# Altium project Flight_Controller.PrjPcb
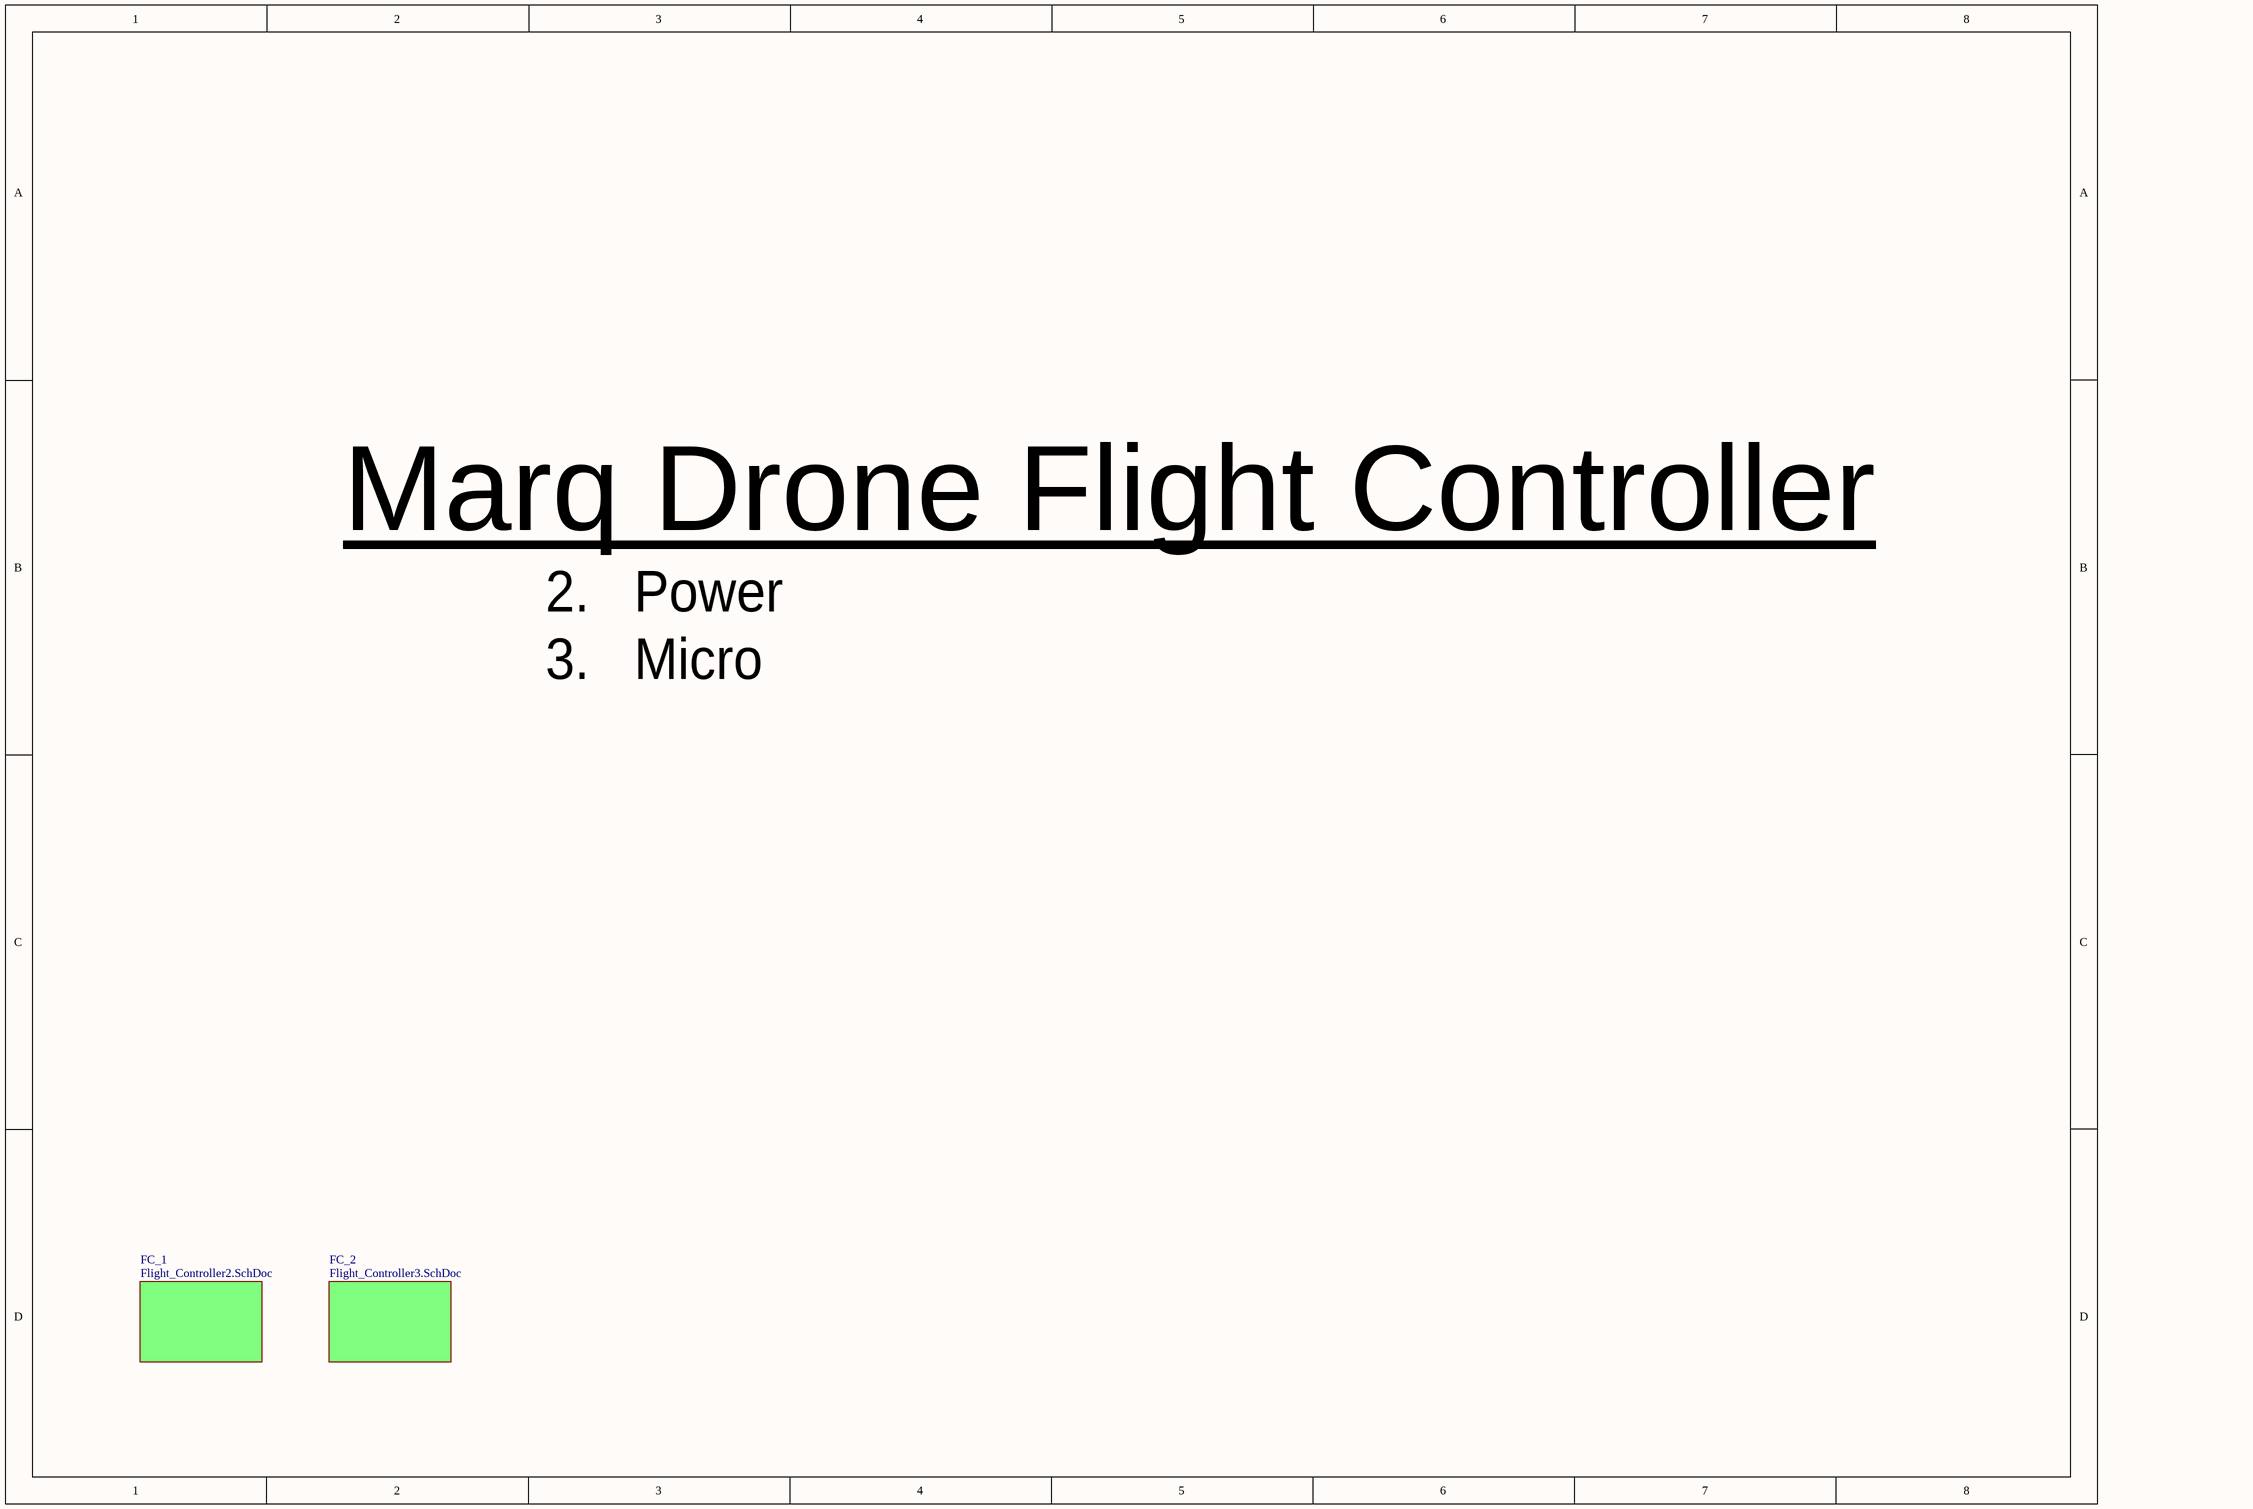
[diagram p0: Flight_Controller1.SchDoc]
3 sheets, 67 parts. Net scope: global (net labels, ports and power ports of the same name join across sheets).
Board file: Flight_Controller.PcbDoc
Sheets:
  Flight_Controller1.SchDoc
    FC_1 = Flight_Controller2.SchDoc
    FC_2 = Flight_Controller3.SchDoc

## Sheet Flight_Controller1.SchDoc: Sensorless BLDC Controller
size A3; PageSetup: Record=PageOptions|CenterHorizontal=True|CenterVertical=True|PrintScale=0.34|XCorrection=1.00|YCorrection=1.00|PrintKind=1|BorderSize=5000000|LeftOffset=0|BottomOffset=0|Orientation=2|PaperLength=1000|PaperWidth=1000|Scale=100|PaperSource=7|PrintQuality=-3|MediaType=1|DitherType=10|PrintScaleMode=1|PaperKind=A3|PaperIndex=8

### Sub-sheets
FC_1 = Flight_Controller2.SchDoc: no entries
FC_2 = Flight_Controller3.SchDoc: no entries

### Notes on the sheet
- Marq Drone Flight Controller
- 2.   Power
- 3.   Micro

## Sheet Flight_Controller2.SchDoc: Sensorless BLDC Controller
size A3; PageSetup: Record=PageOptions|CenterHorizontal=True|CenterVertical=True|PrintScale=0.34|XCorrection=1.00|YCorrection=1.00|PrintKind=1|BorderSize=5000000|LeftOffset=0|BottomOffset=0|Orientation=2|PaperLength=1000|PaperWidth=1000|Scale=100|PaperSource=7|PrintQuality=-3|MediaType=1|DitherType=10|PrintScaleMode=1|PaperKind=A3|PaperIndex=8
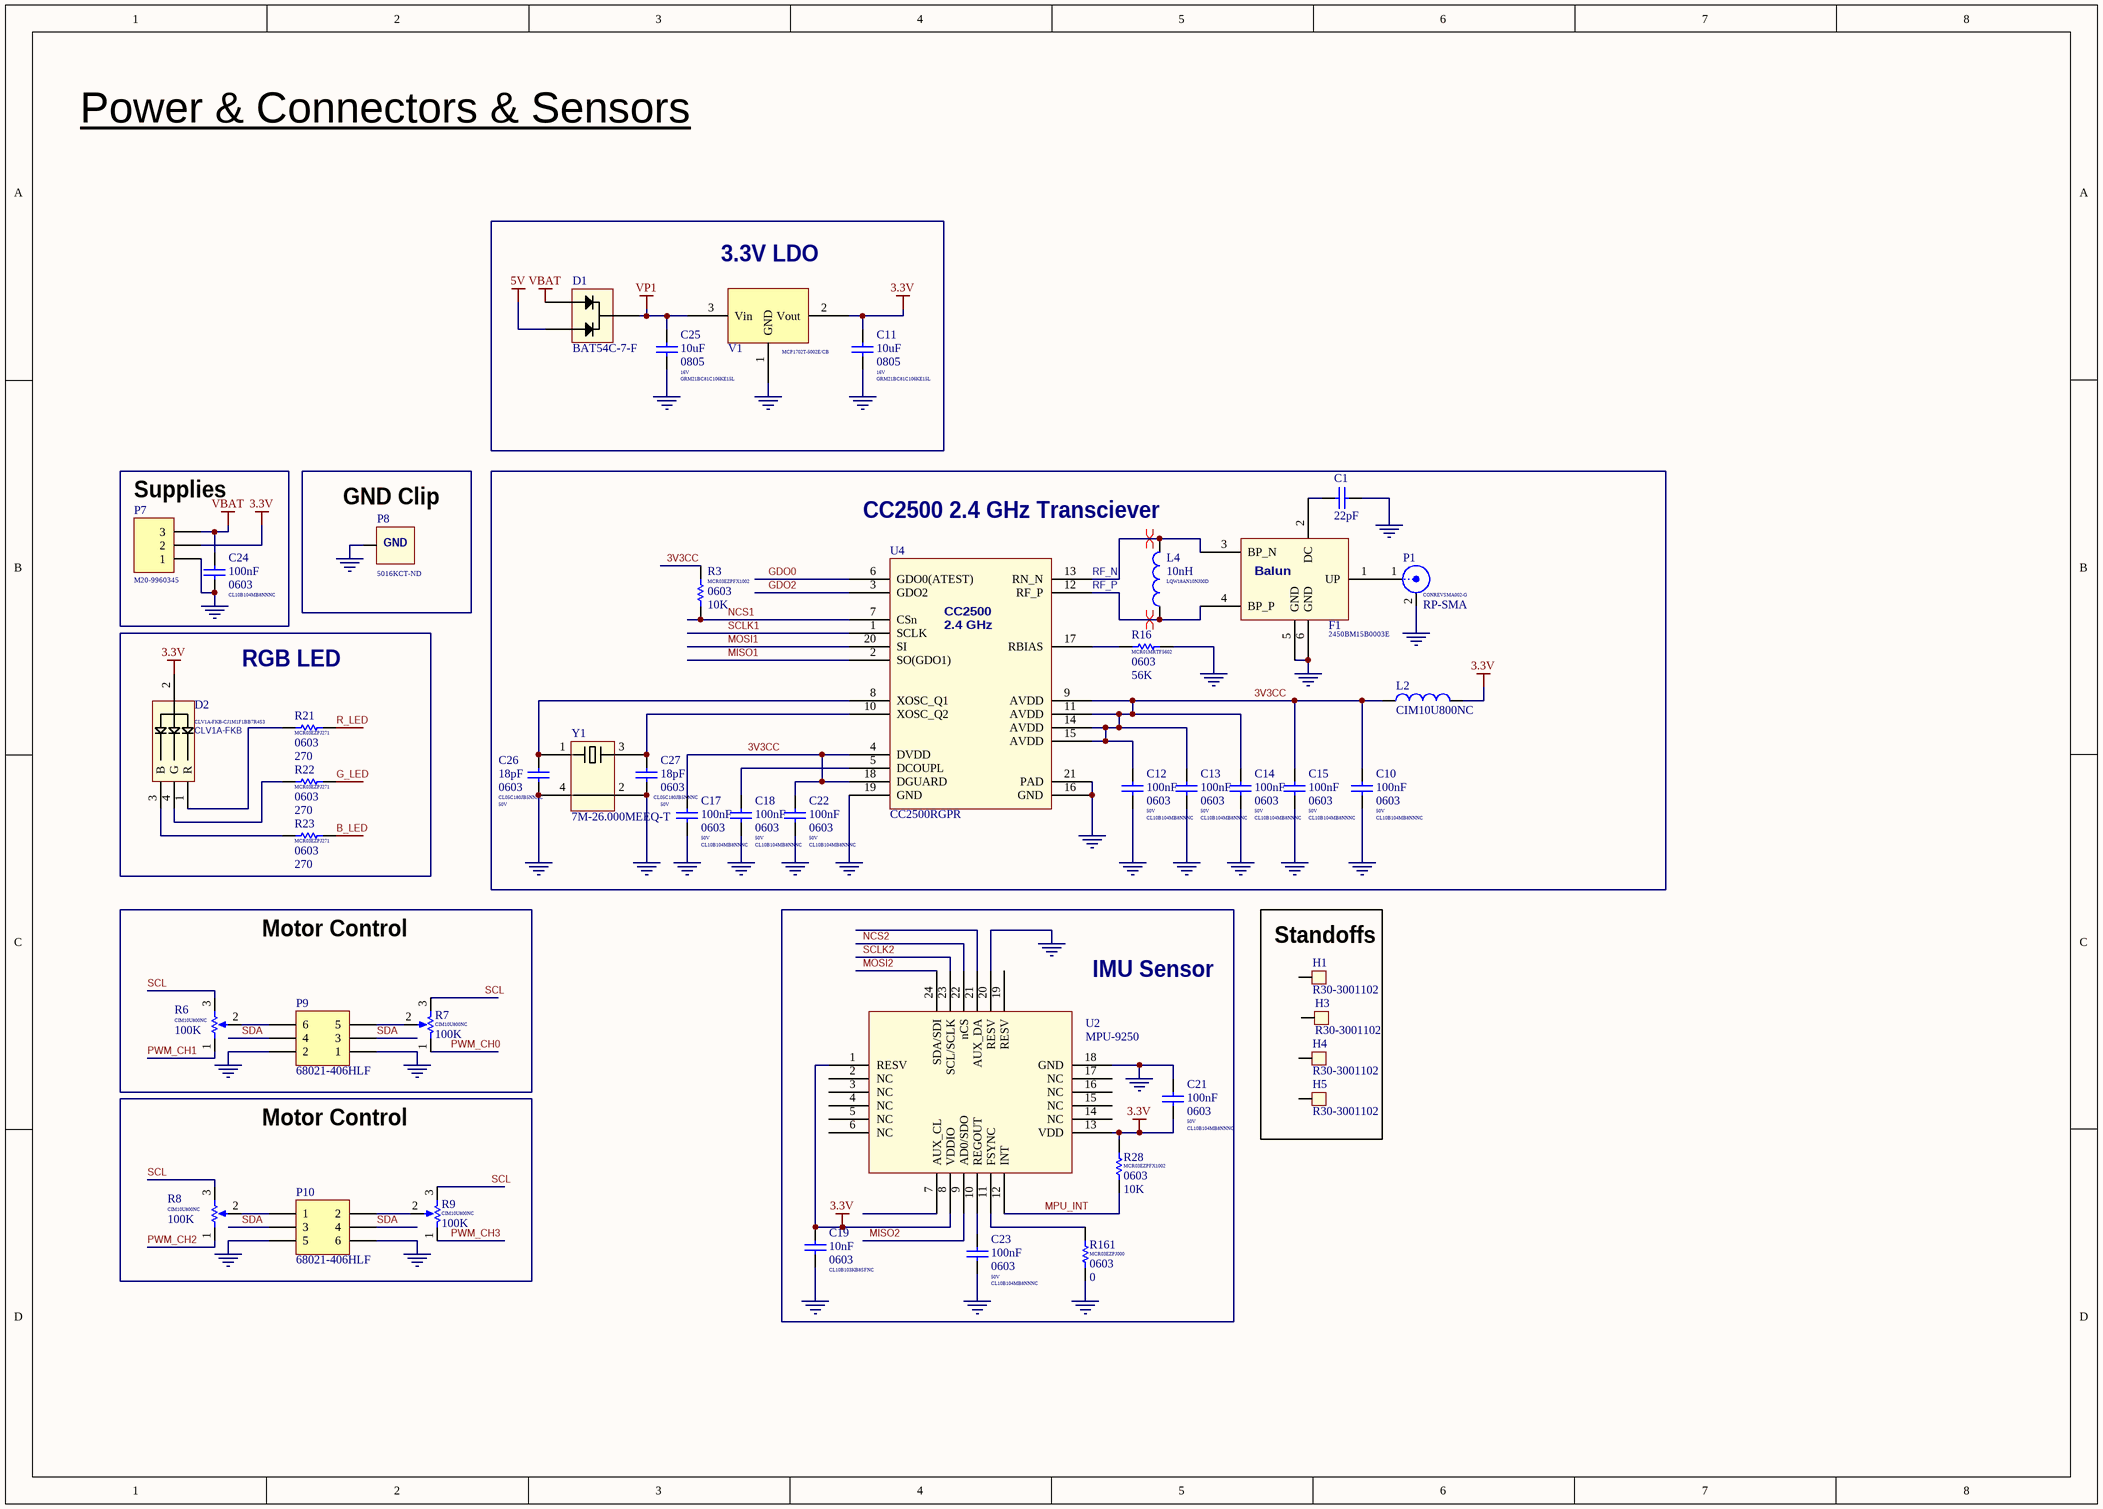
[diagram p1: Flight_Controller2.SchDoc]

### Parts
C1  value 22pF  [1608[0603]C]  (hidden comment: GRM1885C1H220FA01D)
C10  CL10B104MB8NNNC  value 100nF  PackageReference: 0603  Voltage: 50V  [1608[0603]C]
C11  GRM21BC81C106KE15L  value 10uF  PackageReference: 0805  Voltage: 16V  [6-0805_MC]
C12  CL10B104MB8NNNC  value 100nF  PackageReference: 0603  Voltage: 50V  [1608[0603]C]
C13  CL10B104MB8NNNC  value 100nF  PackageReference: 0603  Voltage: 50V  [1608[0603]C]
C14  CL10B104MB8NNNC  value 100nF  PackageReference: 0603  Voltage: 50V  [1608[0603]C]
C15  CL10B104MB8NNNC  value 100nF  PackageReference: 0603  Voltage: 50V  [1608[0603]C]
C17  CL10B104MB8NNNC  value 100nF  PackageReference: 0603  Voltage: 50V  [1608[0603]C]
C18  CL10B104MB8NNNC  value 100nF  PackageReference: 0603  Voltage: 50V  [1608[0603]C]
C19  CL10B103KB8SFNC  value 10nF  PackageReference: 0603  [1608[0603]C]
C21  CL10B104MB8NNNC  value 100nF  PackageReference: 0603  Voltage: 50V  [1608[0603]C]
C22  CL10B104MB8NNNC  value 100nF  PackageReference: 0603  Voltage: 50V  [1608[0603]C]
C23  CL10B104MB8NNNC  value 100nF  PackageReference: 0603  Voltage: 50V  [1608[0603]C]
C24  CL10B104MB8NNNC  value 100nF  PackageReference: 0603  [1608[0603]C]
C25  GRM21BC81C106KE15L  value 10uF  PackageReference: 0805  Voltage: 16V  [6-0805_MC]
C26  CL05C180JB5NNNC  value 18pF  PackageReference: 0603  Voltage: 50V  [1608[0603]C]
C27  CL05C180JB5NNNC  value 18pF  PackageReference: 0603  Voltage: 50V  [1608[0603]C]
D1  BAT54C-7-F  [SOT-23B_M_3D]
D2  CLV1A-FKB-CJ1M1F1BB7R4S3  [CLV1A-FKB_RGB_3D]
F1  2450BM15B0003E  [Balun]
H1  R30-3001102  [M3_Standoff_3]
H3  R30-3001102  [M3_Standoff_3]
H4  R30-3001102  [M3_Standoff_3]
H5  R30-3001102  [M3_Standoff_3]
L2  CIM10U800NC  [1608[0603]L]
L4  LQW18AN10NJ00D  value 10nH  [1608[0603]L]
P1  CONREVSMA002-G  SMA: RP-SMA  [SMA1]
P7  M20-9960345  [HDR1X3]
P8  5016KCT-ND  [GND_CLIP3]
P9  68021-406HLF  [HDR2X3_3D2]
P10  68021-406HLF  [HDR2X3_3D2]
R3  MCR03EZPFX1002  value 10K  PackageReference: 0603  [1608[0603]R]
R6  CIM10U800NC  value 100K  [1608[0603]TRI]
R7  CIM10U800NC  value 100K  [1608[0603]TRI]
R8  CIM10U800NC  value 100K  [1608[0603]TRI]
R9  CIM10U800NC  value 100K  [1608[0603]TRI]
R16  MCR01MRTF5602  value 56K  PackageReference: 0603  [1608[0603]R]
R21  MCR03EZPJ271  value 270  PackageReference: 0603  [1608[0603]R]
R22  MCR03EZPJ271  value 270  PackageReference: 0603  [1608[0603]R]
R23  MCR03EZPJ271  value 270  PackageReference: 0603  [1608[0603]R]
R28  MCR03EZPFX1002  value 10K  PackageReference: 0603  [1608[0603]R]
R161  MCR03EZPJ000  value 0  PackageReference: 0603  [1608[0603]R]
U2  MPU-9250  [QFN-24/3MM]
U4  CC2500RGPR  [QFN50P400X400-20VM]
V1  MCP1702T-5002E/CB  [SOT-23B_M_3D]
Y1  7M-26.000MEEQ-T  [3225_Crystal]

### Blocks framed on the sheet
3.3V LDO: C11 C25 D1 V1
Supplies: C24 P7
GND Clip: P8
CC2500 2.4 GHz Transciever: C1 C10 C12-C15 C17 C18 C22 C26 C27 F1 L2 L4 P1 R3 R16 U4 Y1
RGB LED: D2 R21-R23
Motor Control: P9 R6 R7
IMU Sensor: C19 C21 C23 R28 R161 U2
Standoffs: H1 H3-H5
Motor Control: P10 R8 R9

### Nets
3.3V: C11.2 C19.2 C21.1 D2.2(V+) L2.1 P7.2 R28.2 U2.1(RESV) U2.8(VDDIO) U2.13(VDD) V1.2(Vout)
5V: D1.2
GND: C1.2 C10.1 C11.1 C12.1 C13.1 C14.1 C15.1 C17.1 C18.1 C19.1 C21.2 C22.1 C23.1 C24.1 C25.1 C26.1 C27.1 F1.5(GND) F1.6(GND) P1.2(Y) P7.1 P8.1(GND) P9.1 P9.2 P10.5 P10.6 R16.1 R161.2 U2.18(GND) U2.20(RESV) U4.16(GND) U4.19(GND) U4.21(PAD) V1.1(GND) Y1.2(GND) Y1.4(GND)
VBAT: C24.2 D1.1 P7.3
VP1: C25.2 D1.3 V1.3(Vin)
3V3CC: C10.2 C12.2 C13.2 C14.2 C15.2 C17.2 C22.2 L2.2 R3.2 U4.4(DVDD) U4.9(AVDD) U4.11(AVDD) U4.14(AVDD) U4.15(AVDD) U4.18(DGUARD)
B_LED: R23.2
G_LED: R22.2
GDO0: U4.6(GDO0(ATEST))
GDO2: U4.3(GDO2)
MISO1: U4.2(SO(GDO1))
MISO2: U2.9(AD0/SDO)
MOSI1: U4.20(SI)
MOSI2: U2.24(SDA/SDI)
MPU_INT: R28.1 U2.12(INT)
NCS1: R3.1 U4.7(CSn)
NCS2: U2.22(nCS)
PWM_CH0: R7.1
PWM_CH1: R6.1
PWM_CH2: R8.1
PWM_CH3: R9.1
R_LED: R21.2
RF_N: F1.3(BP_N) L4.1 U4.13(RN_N)
RF_P: F1.4(BP_P) L4.2 U4.12(RF_P)
SCL: R6.3 R7.3 R8.3 R9.3
SCLK1: U4.1(SCLK)
SCLK2: U2.23(SCL/SCLK)
SDA: P9.3 P9.4 P10.3 P10.4
NetC1_1: C1.1 F1.2(DC)
NetC18_2: C18.2 U4.5(DCOUPL)
NetC23_2: C23.2 U2.10(REGOUT)
NetC26_2: C26.2 U4.8(XOSC_Q1) Y1.1(X1)
NetC27_2: C27.2 U4.10(XOSC_Q2) Y1.3(X2)
NetD2_1: D2.1(R) R21.1
NetD2_3: D2.3(B) R23.1
NetD2_4: D2.4(G) R22.1
NetF1_1: F1.1(UP) P1.1(X)
NetP9_5: P9.5 R7.2
NetP9_6: P9.6 R6.2
NetP10_1: P10.1 R8.2
NetP10_2: P10.2 R9.2
NetR16_2: R16.2 U4.17(RBIAS)
NetR161_1: R161.1 U2.11(FSYNC)

Not connected (* = marked no-connect by the designer): H1 1(0); H3 1(0); H4 1(0); H5 1(0); U2 2(NC) 3(NC) 4(NC) 5(NC) 6(NC) 7(AUX_CL) 14(NC) 15(NC) 16(NC) 17(NC) 19(RESV) 21(AUX_DA)

### Layout directives
differential pair: RF_N, RF_P

### Notes on the sheet
- Power & Connectors & Sensors
- (in symbol BALUN_2_4_GHZ) Balun
- (in symbol CC2500_2_4_ghz) CC2500; 2.4 GHz
- (in symbol RGB_LED_SMT) CLV1A-FKB

### Library data of the parts
C1 = Cap Semi: Capacitor (Semiconductor SIM Model); Published: 8-Jun-2000; LatestRevisionDate: 29-May-2009; LatestRevisionNote: IPC-7351 Footprint Added.; PackageReference: C1206; Publisher: Altium Limited; PackageDescription: Chip Capacitor; Digikey: 311-1361-1-ND
C10 C12-C15 C17 C18 C21-C24 = Cap Semi: Capacitor (Semiconductor SIM Model); PP1: 0.01210; Page: PowerInput; PackageDescription: Chip Capacitor; Digikey: 311-1361-1-ND; Part_Number: CL10B104MB8NNNC; PP100: 0.01210
C11 C25 = Cap Semi: Capacitor (Semiconductor SIM Model); Part_Number: CL10B104MB8NNNC; PP1: 0.20000; PP100: 0.06560; Page: Ethernet; PackageDescription: Chip Capacitor; Digikey: 311-1361-1-ND; ClassName: ETH_2; EXT: EXT
C19 = Cap Semi: Capacitor (Semiconductor SIM Model); PP100: 0.00910; Page: Analog; Published: 8-Jun-2000; LatestRevisionDate: 29-May-2009; LatestRevisionNote: IPC-7351 Footprint Added.; Publisher: Altium Limited; PackageDescription: Chip Capacitor; Digikey: 311-1361-1-ND; PP1: 0.00910; ClassName: AI_5
C26 C27 = Cap Semi: Capacitor (Semiconductor SIM Model); PP1: 0.00610; Page: Micro; PackageDescription: Chip Capacitor; Digikey: 311-1361-1-ND; PP100: 0.00610
D1 = Bat45C
D2 = RGB_LED_SMT: SMT RGB LED
F1 = BALUN_2_4_GHZ: 2450BM15B0003; Part Number: 2450BM15B0003
H1 H3-H5 = stand_off: Populate: DNP; Page: PowerInput
L2 = Inductor: PP1: 0.1900; PP100: 0.0620; Page: Micro
L4 = Inductor
P1 = SMB: SMB Straight Connector; Part #: 5-1814832-1
P7 = Header 3: Header, 3-Pin; LatestRevisionDate: 17-Jul-2002; LatestRevisionNote: Re-released for DXP Platform.; Publisher: Altium Limited
P8 = GND_CLIP: PP100: 0.26530; PP1: 0.40000; Page: PowerInput
P9 P10 = Header 3X2: Header, 3-Pin, Dual row; LatestRevisionDate: 17-Jul-2002; LatestRevisionNote: Re-released for DXP Platform.; Publisher: Altium Limited
R3 R16 R28 = Res1: Resistor; Part_Number: MCR03ERTJ102; PP1: 0.10000; PP100: 0.00780; Page: PowerInput
R6-R9 = RPot: Potentiometer; Sim Note: Enter the Resistance value and the set point into parameter fields.; Set Position: 0.5; Published: 8-Jun-2000; LatestRevisionDate: 17-Jul-2002; LatestRevisionNote: Re-released for DXP Platform.; PackageReference: VR5; Publisher: Altium Limited; PackageDescription: Variable Resistor, Thru-Hole; 3 Leads
R21-R23 = Res1: Resistor; Part_Number: MCR03ERTJ102; PP1: 0.10000; PP100: 0.00780; Page: Ethernet; ClassName: ETH_2
R161 = Res1: Resistor; Part_Number: MCR03ERTJ102; PP1: 0.10000; PP100: 0.00620; Page: Analog; ClassName: AI_3
U2 = MPU-9250_LIB
U4 = CC2500_2_4_ghz
V1 = MCP1700: MCP1700 3.3V REG
Y1 = 12MHz_Crystal: 26 MHz Crystal 3225

## Sheet Flight_Controller3.SchDoc: Sensorless BLDC Controller
size A3; PageSetup: Record=PageOptions|CenterHorizontal=True|CenterVertical=True|PrintScale=0.34|XCorrection=1.00|YCorrection=1.00|PrintKind=1|BorderSize=5000000|LeftOffset=0|BottomOffset=0|Orientation=2|PaperLength=1000|PaperWidth=1000|Scale=100|PaperSource=7|PrintQuality=-3|MediaType=1|DitherType=10|PrintScaleMode=1|PaperKind=A3|PaperIndex=8
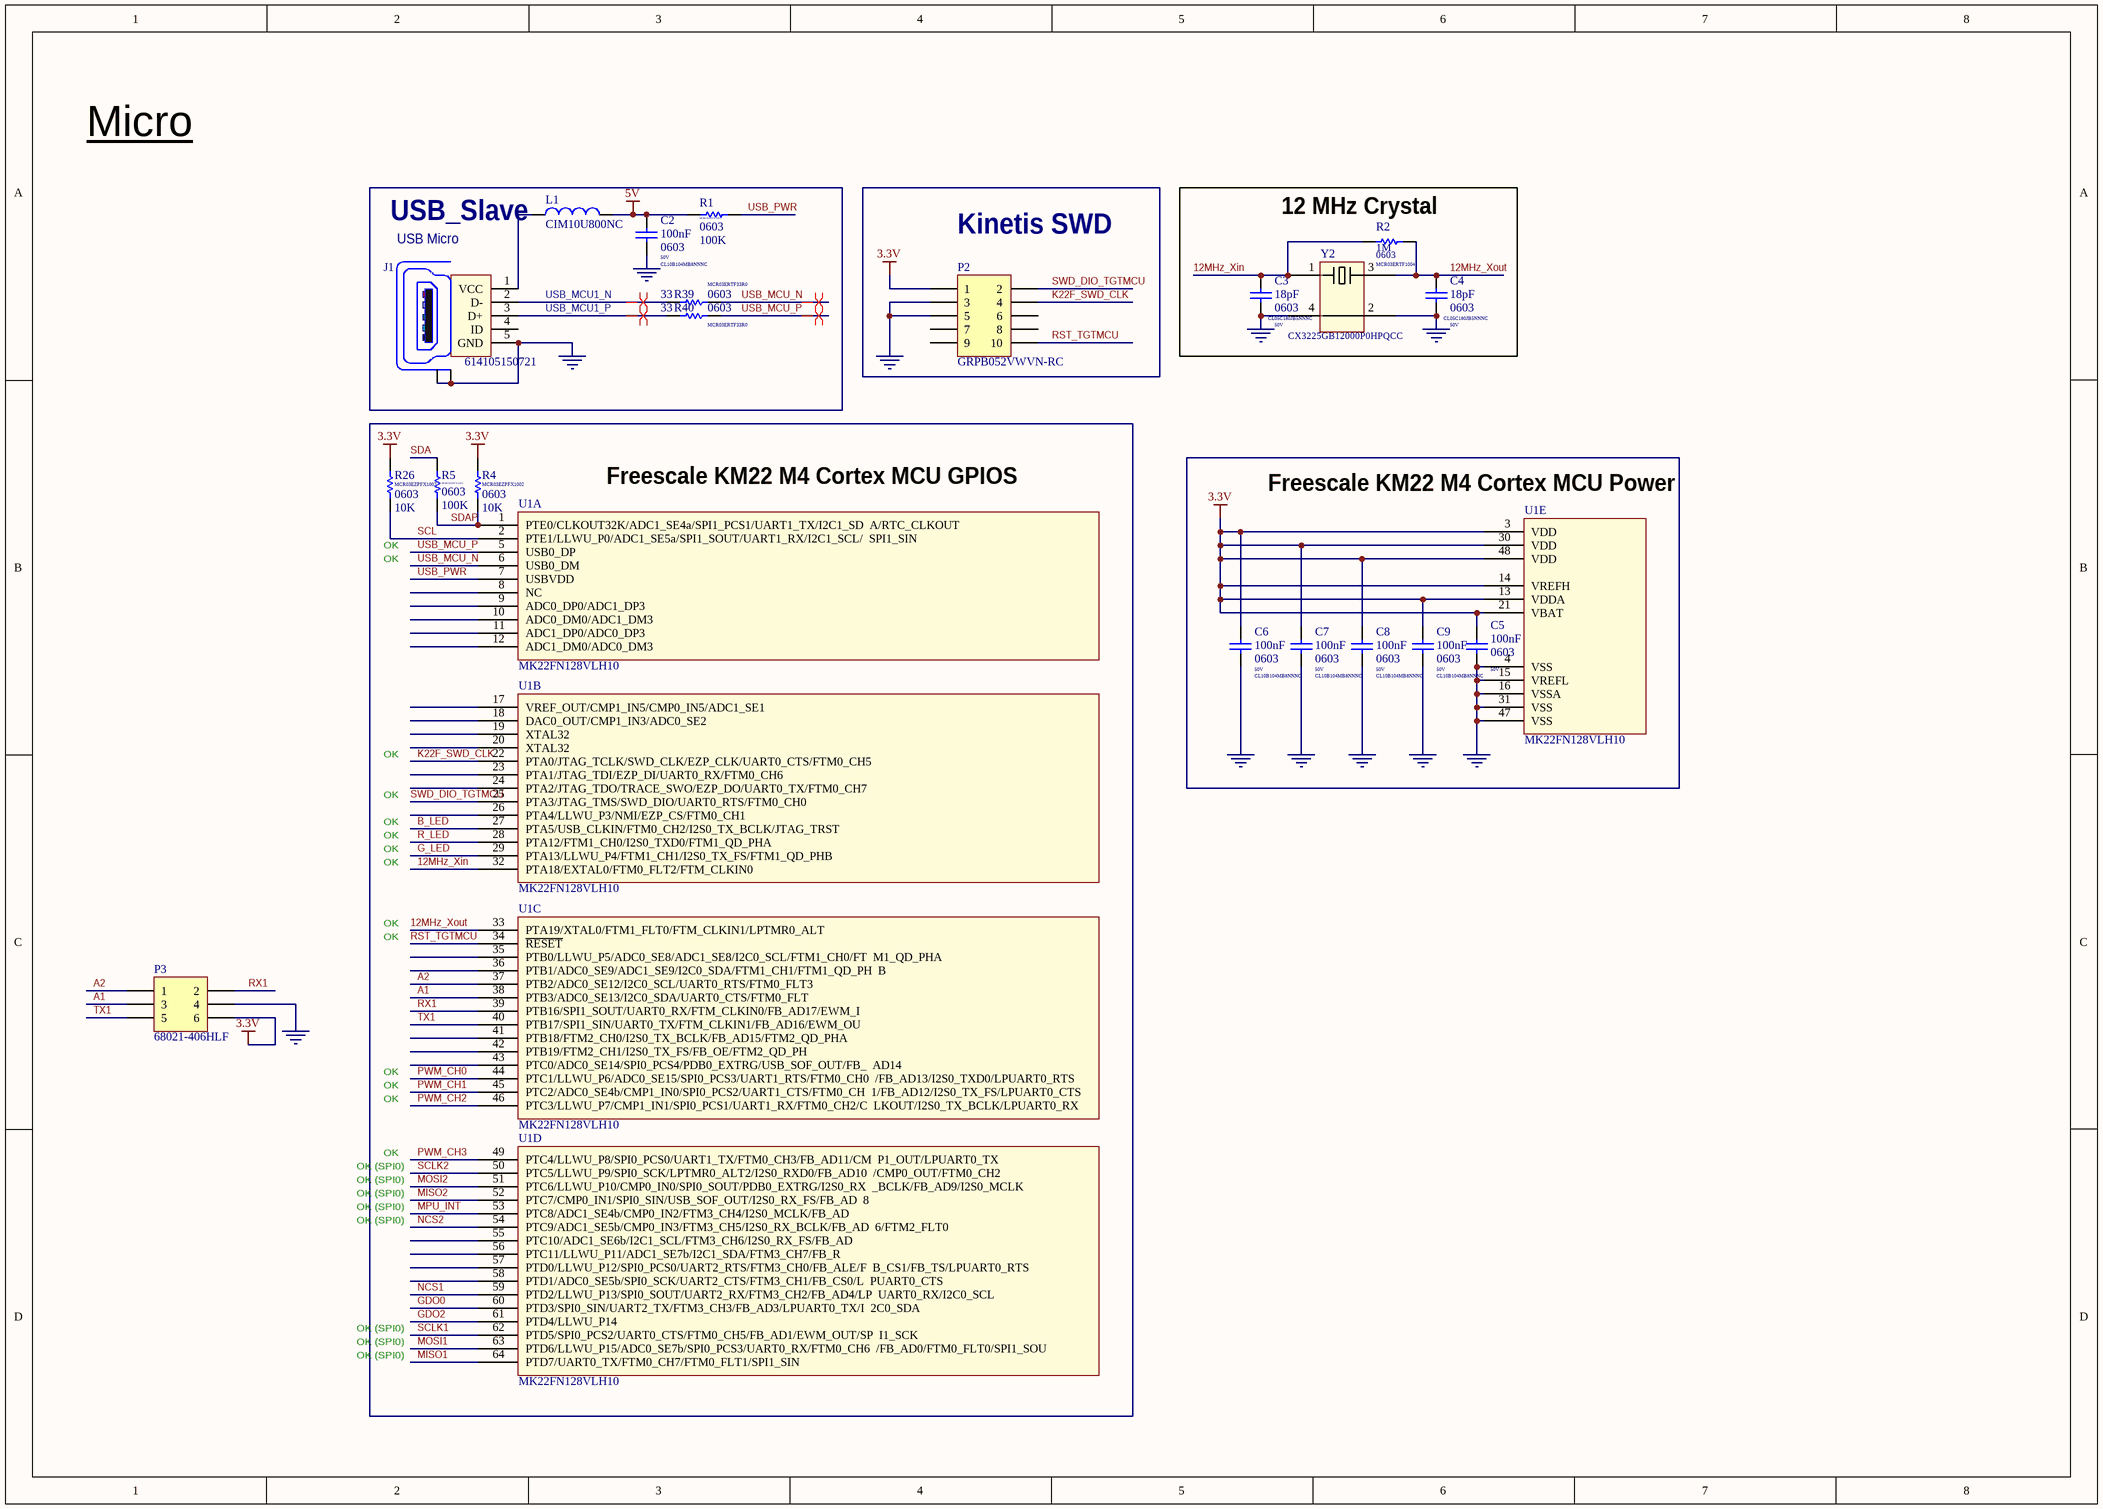
[diagram p2: Flight_Controller3.SchDoc]

### Parts
C2  CL10B104MB8NNNC  value 100nF  PackageReference: 0603  Voltage: 50V  [1608[0603]C]
C3  CL05C180JB5NNNC  value 18pF  PackageReference: 0603  Voltage: 50V  [1608[0603]C]
C4  CL05C180JB5NNNC  value 18pF  PackageReference: 0603  Voltage: 50V  [1608[0603]C]
C5  value 100nF  PackageReference: 0603  Voltage: 50V  [1608[0603]C]  (hidden comment: CL10B104MB8NNNC)
C6  CL10B104MB8NNNC  value 100nF  PackageReference: 0603  Voltage: 50V  [1608[0603]C]
C7  CL10B104MB8NNNC  value 100nF  PackageReference: 0603  Voltage: 50V  [1608[0603]C]
C8  CL10B104MB8NNNC  value 100nF  PackageReference: 0603  Voltage: 50V  [1608[0603]C]
C9  CL10B104MB8NNNC  value 100nF  PackageReference: 0603  Voltage: 50V  [1608[0603]C]
J1  614105150721  [USB_Micro_Vertical]
L1  CIM10U800NC  [1608[0603]L]
P2  GRPB052VWVN-RC  [MHDR2X5]
P3  68021-406HLF  [HDR2X3_3D2]
R1  MCR03EZPFX1003  value 100K  PackageReference: 0603  [1608[0603]R]
R2  MCR03ERTF1004  value 1M  PackageReference: 0603  [1608[0603]R]
R4  MCR03EZPFX1002  value 10K  PackageReference: 0603  [1608[0603]R]
R5  MCR03EZPFX1003  value 100K  PackageReference: 0603  [1608[0603]R]
R26  MCR03EZPFX1002  value 10K  PackageReference: 0603  [1608[0603]R]
R39  MCR03ERTF33R0  value 33  PackageReference: 0603  [1608[0603]R]
R40  MCR03ERTF33R0  value 33  PackageReference: 0603  [1608[0603]R]
U1  MK22FN128VLH10  [LQFP64_10mm_0.5mm]  (parts A,B,C,D,E of 5)
Y2  CX3225GB12000P0HPQCC  [3225_Crystal]

### Blocks framed on the sheet
USB_Slave: C2 J1 L1 R1 R39 R40
Kinetis SWD: P2
12 MHz Crystal: C3 C4 R2 Y2
Freescale KM22 M4 Cortex MCU GPIOS: R4 R5 R26 U1
Freescale KM22 M4 Cortex MCU Power: C5-C9 U1

### Nets
3.3V: C5.2 C6.2 C7.2 C8.2 C9.2 P2.1 P3.6 R4.2 R26.2 U1.3(VDD) U1.13(VDDA) U1.14(VREFH) U1.21(VBAT) U1.30(VDD) U1.48(VDD)
5V: C2.2 L1.1 R1.1
GND: C2.1 C3.1 C4.1 C5.1 C6.1 C7.1 C8.1 C9.1 J1.5(GND) J1.Z1(Shield) J1.Z2(Shield) P2.3 P2.5 P3.4 U1.4(VSS) U1.15(VREFL) U1.16(VSSA) U1.31(VSS) U1.47(VSS) Y2.2(GND) Y2.4(GND)
12MHz_Xin: C3.2 R2.2 U1.32(PTA18/EXTAL0/FTM0_FLT2/FTM_CLKIN0) Y2.1(X1)
12MHz_Xout: C4.2 R2.1 U1.33(PTA19/XTAL0/FTM1_FLT0/FTM_CLKIN1/LPTMR0_ALT) Y2.3(X2)
A1: P3.3 U1.38(PTB3/ADC0_SE13/I2C0_SDA/UART0_CTS/FTM0_FLT)
A2: P3.1 U1.37(PTB2/ADC0_SE12/I2C0_SCL/UART0_RTS/FTM0_FLT3)
B_LED: U1.27(PTA5/USB_CLKIN/FTM0_CH2/I2S0_TX_BCLK/JTAG_TRST)
G_LED: U1.29(PTA13/LLWU_P4/FTM1_CH1/I2S0_TX_FS/FTM1_QD_PHB)
GDO0: U1.60(PTD3/SPI0_SIN/UART2_TX/FTM3_CH3/FB_AD3/LPUART0_TX/I__2C0_SDA)
GDO2: U1.61(PTD4/LLWU_P14)
K22F_SWD_CLK: P2.4 U1.22(PTA0/JTAG_TCLK/SWD_CLK/EZP_CLK/UART0_CTS/FTM0_CH5)
MISO1: U1.64(PTD7/UART0_TX/FTM0_CH7/FTM0_FLT1/SPI1_SIN)
MISO2: U1.52(PTC7/CMP0_IN1/SPI0_SIN/USB_SOF_OUT/I2S0_RX_FS/FB_AD__8)
MOSI1: U1.63(PTD6/LLWU_P15/ADC0_SE7b/SPI0_PCS3/UART0_RX/FTM0_CH6__/FB_AD0/FTM0_FLT0/SPI1_SOU)
MOSI2: U1.51(PTC6/LLWU_P10/CMP0_IN0/SPI0_SOUT/PDB0_EXTRG/I2S0_RX___BCLK/FB_AD9/I2S0_MCLK)
MPU_INT: U1.53(PTC8/ADC1_SE4b/CMP0_IN2/FTM3_CH4/I2S0_MCLK/FB_AD)
NCS1: U1.59(PTD2/LLWU_P13/SPI0_SOUT/UART2_RX/FTM3_CH2/FB_AD4/LP__UART0_RX/I2C0_SCL)
NCS2: U1.54(PTC9/ADC1_SE5b/CMP0_IN3/FTM3_CH5/I2S0_RX_BCLK/FB_AD__6/FTM2_FLT0)
PWM_CH0: U1.44(PTC1/LLWU_P6/ADC0_SE15/SPI0_PCS3/UART1_RTS/FTM0_CH0__/FB_AD13/I2S0_TXD0/LPUART0_RTS)
PWM_CH1: U1.45(PTC2/ADC0_SE4b/CMP1_IN0/SPI0_PCS2/UART1_CTS/FTM0_CH__1/FB_AD12/I2S0_TX_FS/LPUART0_CTS)
PWM_CH2: U1.46(PTC3/LLWU_P7/CMP1_IN1/SPI0_PCS1/UART1_RX/FTM0_CH2/C__LKOUT/I2S0_TX_BCLK/LPUART0_RX)
PWM_CH3: U1.49(PTC4/LLWU_P8/SPI0_PCS0/UART1_TX/FTM0_CH3/FB_AD11/CM__P1_OUT/LPUART0_TX)
R_LED: U1.28(PTA12/FTM1_CH0/I2S0_TXD0/FTM1_QD_PHA)
RST_TGTMCU: P2.10 U1.34(~{RESET})
RX1: P3.2 U1.39(PTB16/SPI1_SOUT/UART0_RX/FTM_CLKIN0/FB_AD17/EWM_I)
SCL: R26.1 U1.2(PTE1/LLWU_P0/ADC1_SE5a/SPI1_SOUT/UART1_RX/I2C1_SCL/__SPI1_SIN)
SCLK1: U1.62(PTD5/SPI0_PCS2/UART0_CTS/FTM0_CH5/FB_AD1/EWM_OUT/SP__I1_SCK)
SCLK2: U1.50(PTC5/LLWU_P9/SPI0_SCK/LPTMR0_ALT2/I2S0_RXD0/FB_AD10__/CMP0_OUT/FTM0_CH2)
SDA: R5.2
SDAP: R4.1 R5.1 U1.1(PTE0/CLKOUT32K/ADC1_SE4a/SPI1_PCS1/UART1_TX/I2C1_SD__A/RTC_CLKOUT)
SWD_DIO_TGTMCU: P2.2 U1.25(PTA3/JTAG_TMS/SWD_DIO/UART0_RTS/FTM0_CH0)
TX1: P3.5 U1.40(PTB17/SPI1_SIN/UART0_TX/FTM_CLKIN1/FB_AD16/EWM_OU)
USB_MCU1_N: J1.2(D-) R39.2
USB_MCU1_P: J1.3(D+) R40.2
USB_MCU_N: R39.1 U1.6(USB0_DM)
USB_MCU_P: R40.1 U1.5(USB0_DP)
USB_PWR: R1.2 U1.7(USBVDD)
NetJ1_1: J1.1(VCC) L1.2

Not connected (* = marked no-connect by the designer): J1 4(ID); P2 6 7 8 9; U1 8(NC) 9(ADC0_DP0/ADC1_DP3) 10(ADC0_DM0/ADC1_DM3) 11(ADC1_DP0/ADC0_DP3) 12(ADC1_DM0/ADC0_DM3) 17(VREF_OUT/CMP1_IN5/CMP0_IN5/ADC1_SE1) 18(DAC0_OUT/CMP1_IN3/ADC0_SE2) 19(XTAL32) 20(XTAL32) 23(PTA1/JTAG_TDI/EZP_DI/UART0_RX/FTM0_CH6) 24(PTA2/JTAG_TDO/TRACE_SWO/EZP_DO/UART0_TX/FTM0_CH7) 26(PTA4/LLWU_P3/NMI/EZP_CS/FTM0_CH1) 35(PTB0/LLWU_P5/ADC0_SE8/ADC1_SE8/I2C0_SCL/FTM1_CH0/FT__M1_QD_PHA) 36(PTB1/ADC0_SE9/ADC1_SE9/I2C0_SDA/FTM1_CH1/FTM1_QD_PH__B) 41(PTB18/FTM2_CH0/I2S0_TX_BCLK/FB_AD15/FTM2_QD_PHA) 42(PTB19/FTM2_CH1/I2S0_TX_FS/FB_OE/FTM2_QD_PH) 43(PTC0/ADC0_SE14/SPI0_PCS4/PDB0_EXTRG/USB_SOF_OUT/FB___AD14) 55(PTC10/ADC1_SE6b/I2C1_SCL/FTM3_CH6/I2S0_RX_FS/FB_AD) 56(PTC11/LLWU_P11/ADC1_SE7b/I2C1_SDA/FTM3_CH7/FB_R) 57(PTD0/LLWU_P12/SPI0_PCS0/UART2_RTS/FTM3_CH0/FB_ALE/F__B_CS1/FB_TS/LPUART0_RTS) 58(PTD1/ADC0_SE5b/SPI0_SCK/UART2_CTS/FTM3_CH1/FB_CS0/L__PUART0_CTS)

### Layout directives
differential pair: USB_MCU1_N, USB_MCU1_P, USB_MCU_N, USB_MCU_P

### Notes on the sheet
- Micro
- (near J1) USB Micro
- OK
- OK (SPI0)

### Library data of the parts
C2 C5-C9 = Cap Semi: Capacitor (Semiconductor SIM Model); PP1: 0.01210; Page: Micro; PackageDescription: Chip Capacitor; Digikey: 311-1361-1-ND; Part_Number: CL10B104MB8NNNC; PP100: 0.01210
C3 C4 = Cap Semi: as C26 on sheet Flight_Controller2; PackageDescription: Chip Capacitor; Digikey: 311-1361-1-ND; PP100: 0.00610
J1 = WR-Communication Connectors 614105150721: WR-COM_USB_Micro Type B_Vertical_THT; Manufacturer: Würth Elektronik eiSos GmbH; ComponentLink1 Description: Manufacturer; ComponentLink2 Description: Datasheet; NoPins: 5; ComponentLink1URL: http://www.we-online.de; ComponentLink2URL: http://katalog.we-online.de/em/datasheet/614105150721.pdf; Created by: Karrer Zheng; Created Date: 10/25/2014; partNo: 614105150721
L1 = Inductor: PP1: 0.1900; PP100: 0.0620; Page: Micro
P2 = Header 5X2: Header, 5-Pin, Dual row; LatestRevisionDate: 17-Jul-2002; LatestRevisionNote: Re-released for DXP Platform.; Publisher: Altium Limited
P3 = Header 3X2: Header, 3-Pin, Dual row; LatestRevisionDate: 17-Jul-2002; LatestRevisionNote: Re-released for DXP Platform.; Publisher: Altium Limited
R1 R5 = Res1: Resistor; Part_Number: MCR03ERTJ104; PP1: 0.00420; Page: Micro; PP100: 0.00420
R2 = Res1: Resistor; PP1: 0.00470; Page: Ethernet; PP100: 0.00470; ClassName: ETH_2; EXT: EXT
R4 R26 = Res1: as R3 on sheet Flight_Controller2
R39 = Res1: Resistor; PP1: 0.10000; PP100: 0.00620; Page: Micro
R40 = Res1: Resistor; Part_Number: MCR03ERTJ102; PP1: 0.10000; PP100: 0.00620; Page: Micro
U1 = MK22FN128VLH10: MK22FN128VLH10 MCU
Y2 = 12MHz_Crystal: 12MHz Micro Crystal; PP1: 0.64000; PP100: 0.47000; Value: 12MHz; Page: Micro

## Nets that join several sheets
3.3V: Flight_Controller2 (11 pins), Flight_Controller3 (15 pins)
5V: Flight_Controller2 (D1.2), Flight_Controller3 (C2.2 L1.1 R1.1)
GND: Flight_Controller2 (36 pins), Flight_Controller3 (21 pins)
B_LED: Flight_Controller2 (R23.2), Flight_Controller3 (U1.27)
G_LED: Flight_Controller2 (R22.2), Flight_Controller3 (U1.29)
GDO0: Flight_Controller2 (U4.6), Flight_Controller3 (U1.60)
GDO2: Flight_Controller2 (U4.3), Flight_Controller3 (U1.61)
MISO1: Flight_Controller2 (U4.2), Flight_Controller3 (U1.64)
MISO2: Flight_Controller2 (U2.9), Flight_Controller3 (U1.52)
MOSI1: Flight_Controller2 (U4.20), Flight_Controller3 (U1.63)
MOSI2: Flight_Controller2 (U2.24), Flight_Controller3 (U1.51)
MPU_INT: Flight_Controller2 (R28.1 U2.12), Flight_Controller3 (U1.53)
NCS1: Flight_Controller2 (R3.1 U4.7), Flight_Controller3 (U1.59)
NCS2: Flight_Controller2 (U2.22), Flight_Controller3 (U1.54)
PWM_CH0: Flight_Controller2 (R7.1), Flight_Controller3 (U1.44)
PWM_CH1: Flight_Controller2 (R6.1), Flight_Controller3 (U1.45)
PWM_CH2: Flight_Controller2 (R8.1), Flight_Controller3 (U1.46)
PWM_CH3: Flight_Controller2 (R9.1), Flight_Controller3 (U1.49)
R_LED: Flight_Controller2 (R21.2), Flight_Controller3 (U1.28)
SCL: Flight_Controller2 (R6.3 R7.3 R8.3 R9.3), Flight_Controller3 (R26.1 U1.2)
SCLK1: Flight_Controller2 (U4.1), Flight_Controller3 (U1.62)
SCLK2: Flight_Controller2 (U2.23), Flight_Controller3 (U1.50)
SDA: Flight_Controller2 (P9.3 P9.4 P10.3 P10.4), Flight_Controller3 (R5.2)